# EAGLE design energy_shield (EAGLE 9.4.2)
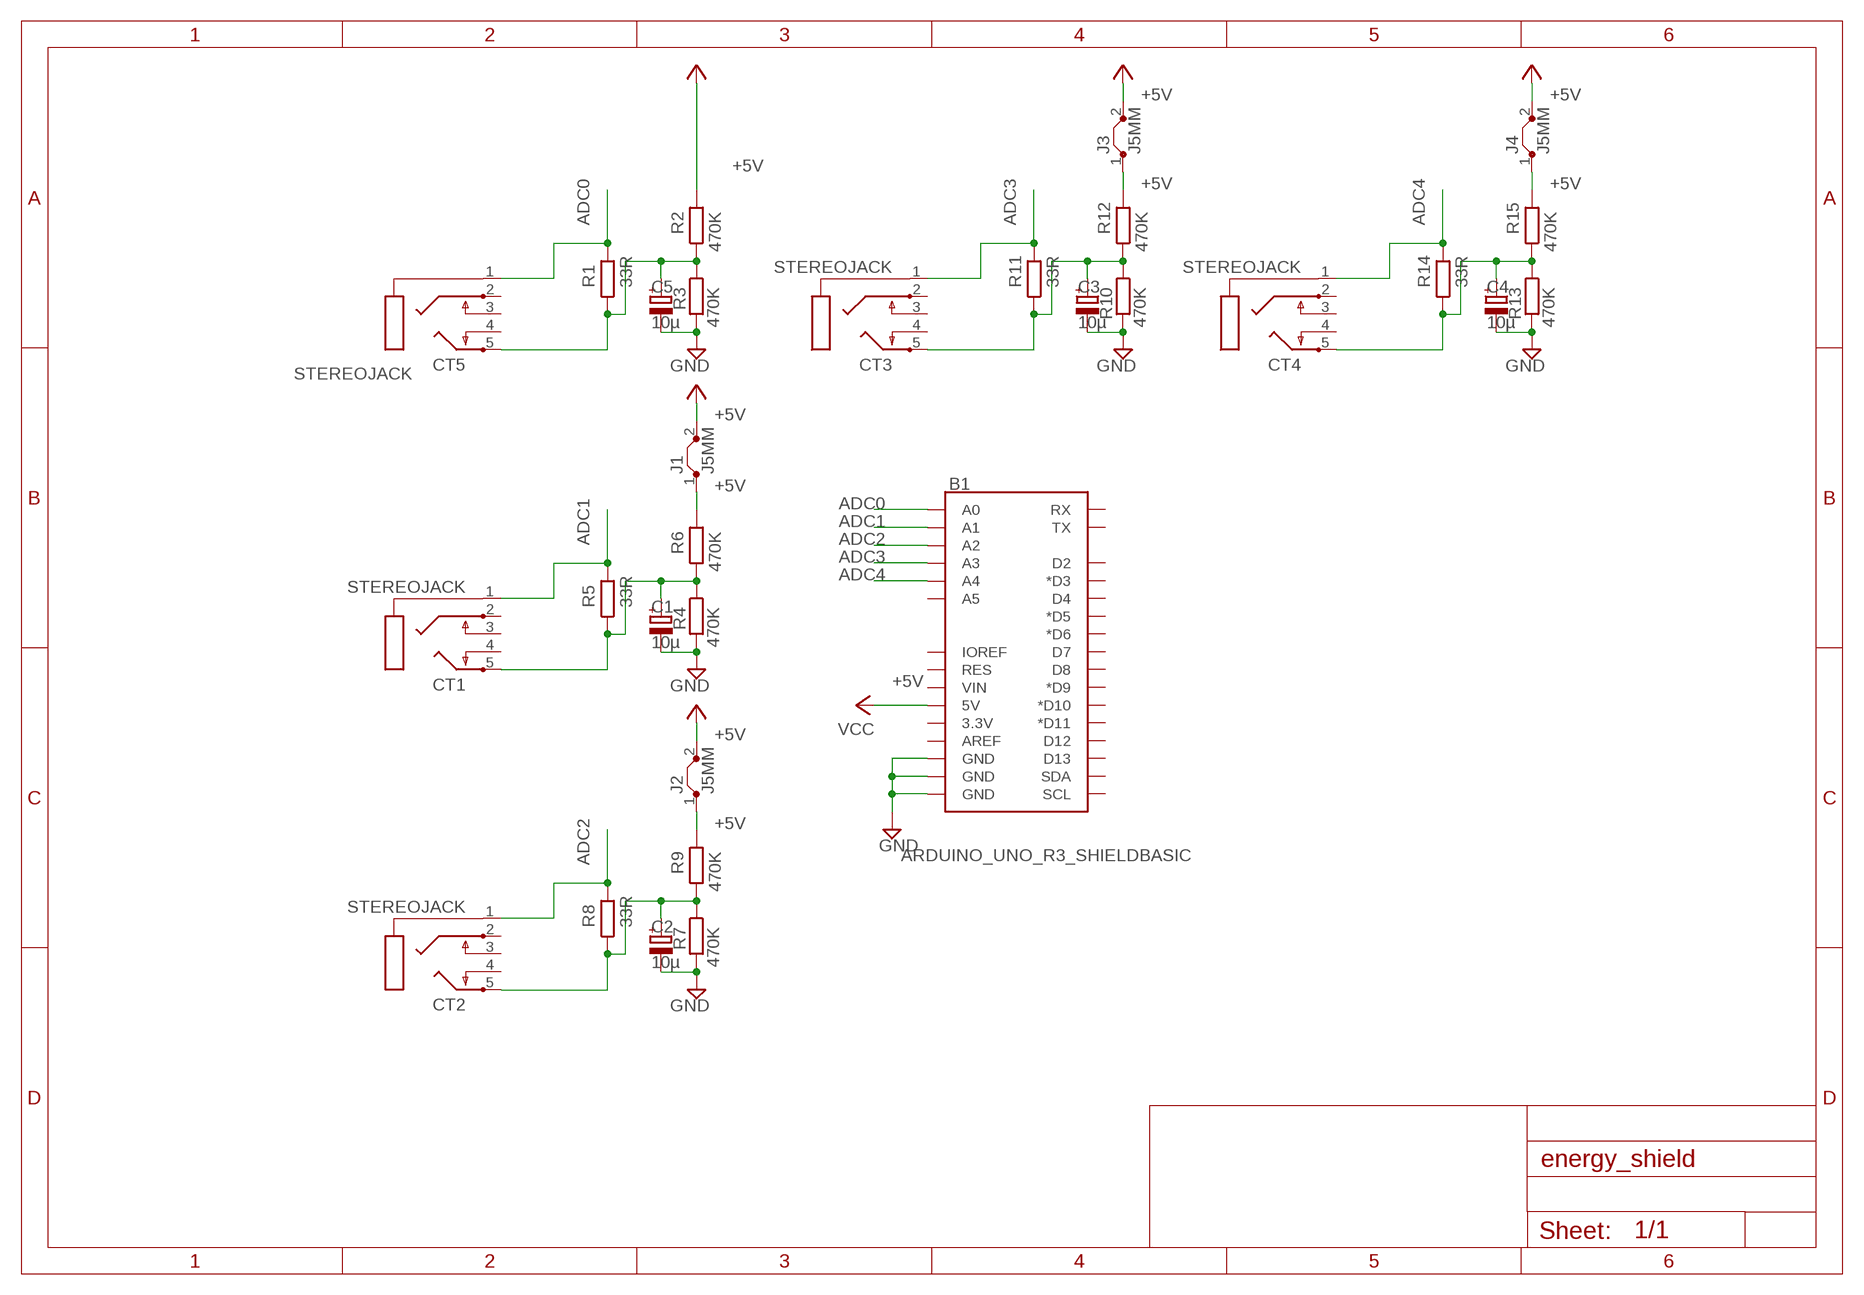
[diagram p0: schematic, sheet 1]

## Parts
B1  ARDUINO_UNO_R3_SHIELDBASIC  [UNO_R3_SHIELD]
C1  10µ  CPOL-EUE1.8-4  [E1,8-4]
C2  10µ  CPOL-EUE1.8-4  [E1,8-4]
C3  10µ  CPOL-EUE1.8-4  [E1,8-4]
C4  10µ  CPOL-EUE1.8-4  [E1,8-4]
C5  10µ  CPOL-EUE1.8-4  [E1,8-4]
CT1  STEREOJACK  [STX3100]
CT2  STEREOJACK  [STX3100]
CT3  STEREOJACK  [STX3100]
CT4  STEREOJACK  [STX3100]
CT5  STEREOJACK  [STX3100]
J1  J5MM  [05]
J2  J5MM  [05]
J3  J5MM  [05]
J4  J5MM  [05]
R1  33R  R-EU_0204/7  [0204/7]
R2  470K  R-EU_0204/7  [0204/7]
R3  470K  R-EU_0204/7  [0204/7]
R4  470K  R-EU_0204/7  [0204/7]
R5  33R  R-EU_0204/7  [0204/7]
R6  470K  R-EU_0204/7  [0204/7]
R7  470K  R-EU_0204/7  [0204/7]
R8  33R  R-EU_0204/7  [0204/7]
R9  470K  R-EU_0204/7  [0204/7]
R10  470K  R-EU_0204/7  [0204/7]
R11  33R  R-EU_0204/7  [0204/7]
R12  470K  R-EU_0204/7  [0204/7]
R13  470K  R-EU_0204/7  [0204/7]
R14  33R  R-EU_0204/7  [0204/7]
R15  470K  R-EU_0204/7  [0204/7]

## Nets
+5V [power]: B1.5V J1.1 J1.2 J2.1 J2.2 J3.1 J3.2 J4.1 J4.2 R2.2 R6.2 R9.2 R12.2 R15.2 ; supply symbol labelled VCC
ADC0: B1.A0 CT5.1 R1.2
ADC1: B1.A1 CT1.1 R5.2
ADC2: B1.A2 CT2.1 R8.2
ADC3: B1.A3 CT3.1 R11.2
ADC4: B1.A4 CT4.1 R14.2
GND [gnd]: B1.GND@0(GND) B1.GND@1(GND) B1.GND@2(GND) C1.- C2.- C3.- C4.- C5.- R3.2 R4.2 R7.2 R10.2 R13.2
N$1: C1.+ CT1.5 R4.1 R5.1 R6.1
N$2: C2.+ CT2.5 R7.1 R8.1 R9.1
N$3: C3.+ CT3.5 R10.1 R11.1 R12.1
N$4: C5.+ CT5.5 R1.1 R2.1 R3.1
N$5: C4.+ CT4.5 R13.1 R14.1 R15.1
Unconnected: B1.3.3V B1.A5 B1.AREF B1.D2 B1.D3(*D3) B1.D4 B1.D5(*D5) B1.D6(*D6) B1.D7 B1.D8 B1.D9(*D9) B1.D10(*D10) B1.D11(*D11) B1.D12 B1.D13 B1.IOREF B1.RES B1.RX B1.SCL B1.SDA B1.TX B1.VIN CT1.2 CT1.3 CT1.4 CT2.2 CT2.3 CT2.4 CT3.2 CT3.3 CT3.4 CT4.2 CT4.3 CT4.4 CT5.2 CT5.3 CT5.4

## Library data of the parts
B1 = SparkFun-Boards:ARDUINO_UNO_R3_SHIELD: Arduino R3 Shield Footprint Shield form compatible with the Arduino Uno R3. SparkFun Products: MG2639 Cellular Shield <https://www.sparkfun.com/products/13120> MIDI Shield <https://www.sparkfun.com/products/12898> R3 Stackable Headers Kit <https://www.sparkfun.com/products/11417>
C1-C5 = resistor:CPOL-EU: POLARIZED CAPACITOR, European symbol
CT1-CT5 = adafruit:STEREOJACK: MIC/HEADPHONE JACK Stereo jack with two switches. Kycon STX3100, CUI SJ1-3555NG and/or 4UCon 05544
J1-J4 = jumper:J: Bridge
R1 R2 R5 R13 = rcl:R-EU_: RESISTOR, European symbol; SPICEPREFIX: R
R3 R4 R6-R12 R14 R15 = rcl:R-EU_: RESISTOR, European symbol

## Net classes
0 default: width 0.203 mm, drill 0.6 mm, clearance 0.203 mm
1 power: width 0.305 mm, drill 0.6 mm, clearance 0.254 mm
2 gnd: width 0.254 mm, drill 0.6 mm, clearance 0.254 mm

## Board
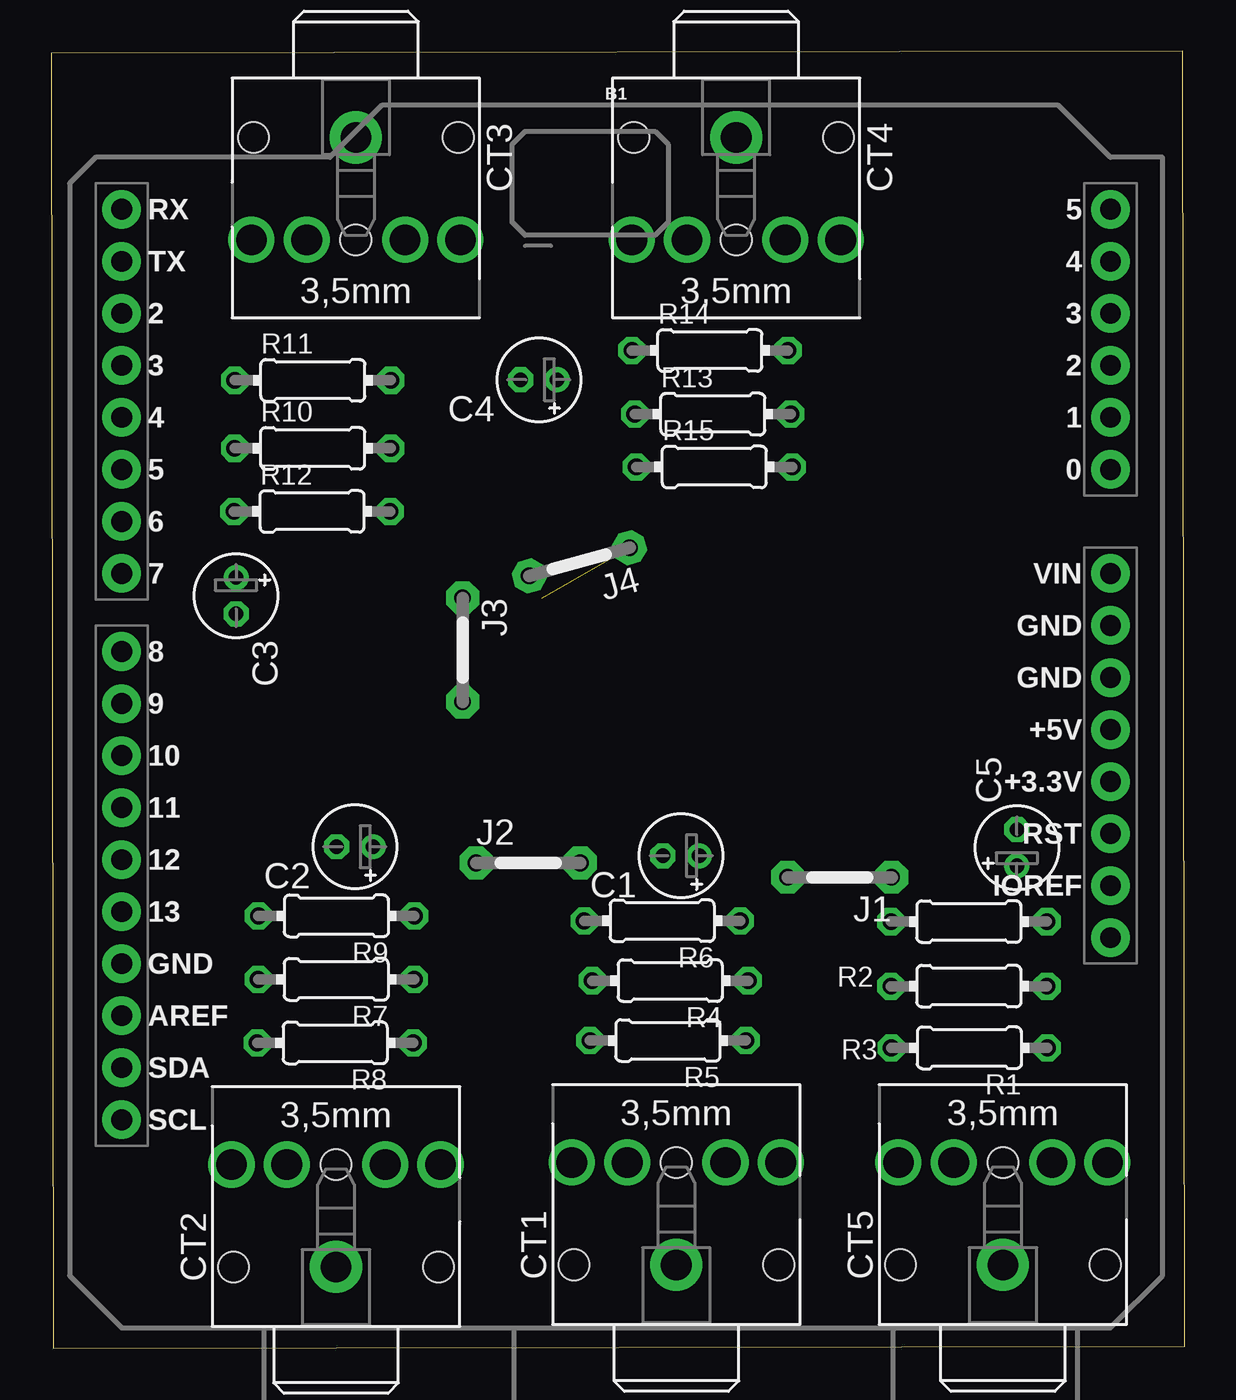
[diagram p1: board, top side]
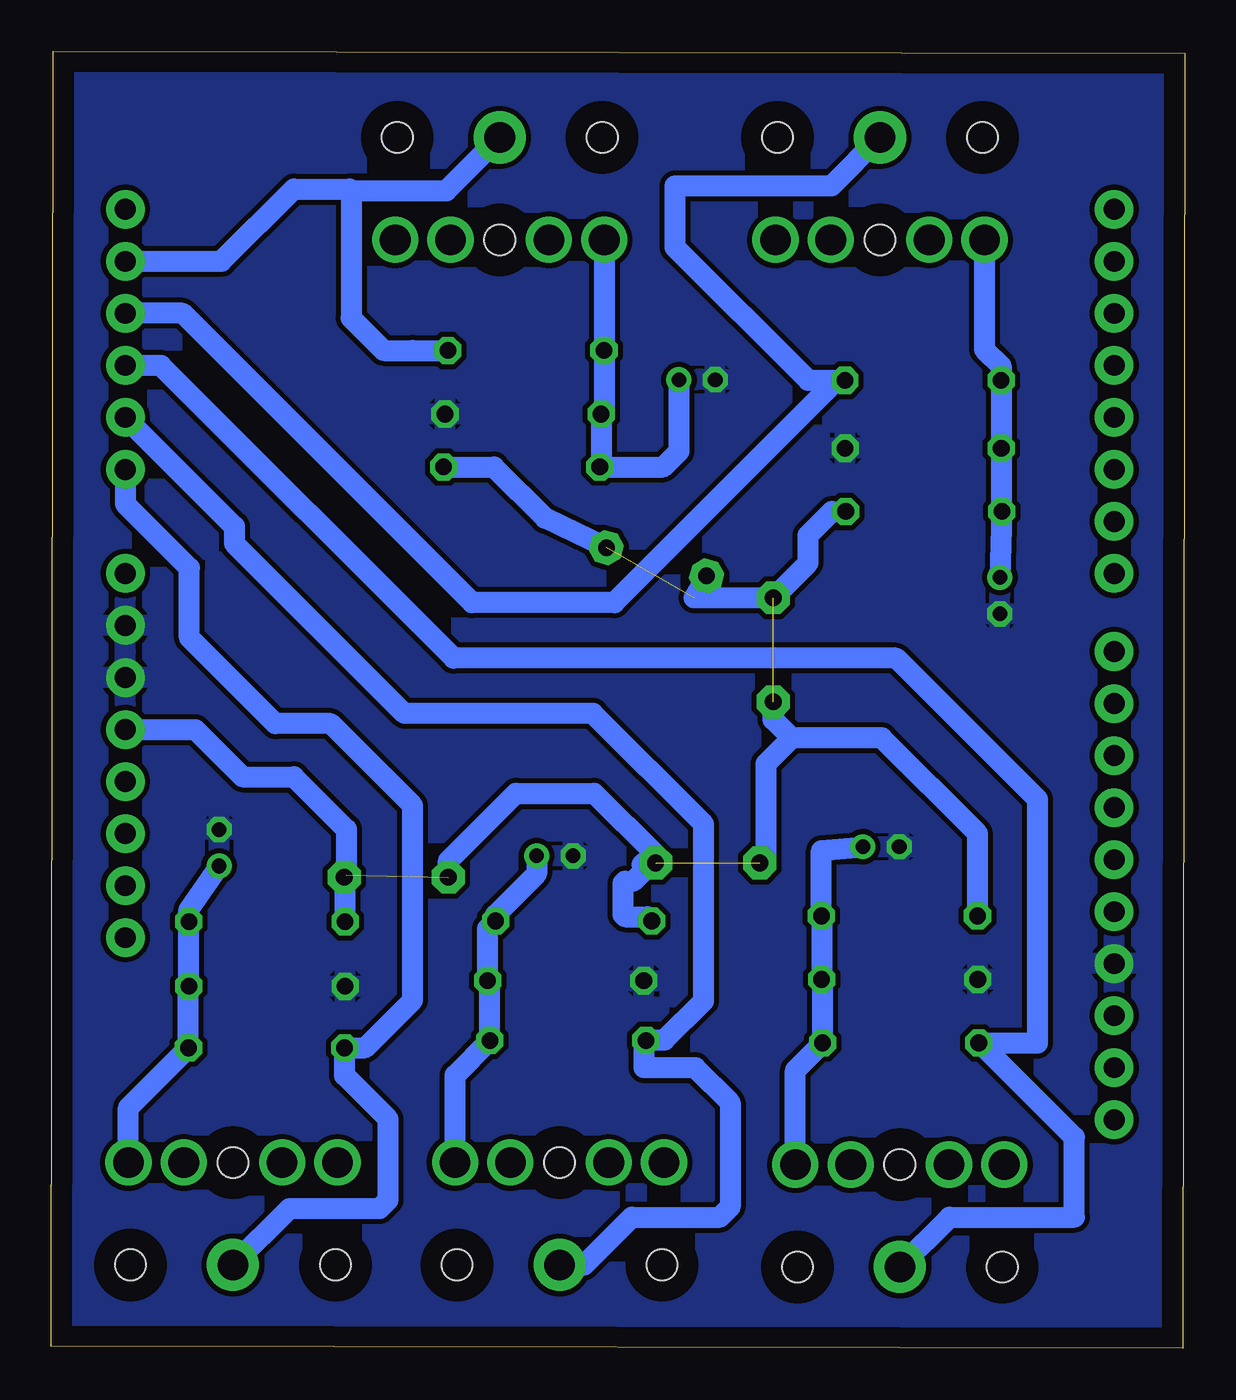
[diagram p2: board, bottom side, seen from below]

Size 55.32 x 63.33 mm. Coordinates in mm from the lower left corner, seen from the top.
Outline: 0.1,0 55.32,0.1 55.22,63.33 0,63.23 0.1,0
Copper layers (1*16): Top 0.035mm / dielectric 1.5mm / Bottom 0.035mm
Design rules "default": minimum track width 6mil, minimum drill 0.35mm, track to track 6mil, track to pad 6mil, pad to pad 6mil, via to via 6mil, smd to smd 6mil, copper to edge 40mil, drill to drill 6mil, minimum pad ring 10mil, minimum via ring 8mil, stop-mask expansion 4mil, vias tented up to drill 0mil, thermal gap 10mil

### Footprints (pad centres in the part's own frame; a part is rotated, then mirrored left to right if it is on the bottom)
UNO_R3_SHIELD = drill 1.016 pad 1.88: 3.3V 24.13,-2.54; 5V 24.13,0; A0 24.13,12.7; A1 24.13,15.24; A2 24.13,17.78; A3 24.13,20.32; A4 24.13,22.86; A5 24.13,25.4; AREF -24.13,-13.97; D2 -24.13,20.32; D3 -24.13,17.78; D4 -24.13,15.24; D5 -24.13,12.7; D6 -24.13,10.16; D7 -24.13,7.62; D8 -24.13,3.81; D9 -24.13,1.27; D10 -24.13,-1.27; D11 -24.13,-3.81; D12 -24.13,-6.35; D13 -24.13,-8.89; GND@0 24.13,2.54; GND@1 24.13,5.08; GND@2 -24.13,-11.43; IOREF 24.13,-7.62; NC 24.13,-10.16; RES 24.13,-5.08; RX -24.13,25.4; SCL -24.13,-19.05; SDA -24.13,-16.51; TX -24.13,22.86; VIN 24.13,7.62
E1,8-4 = drill 0.711 pad 1.168: + -0.889,0 | drill 0.711 pad 1.168 octagon: - 0.889,0
STX3100 = drill 1.5 pad 2.54: 1 2.7,-0.1 | drill 1.5: 2 7.7,5; 3 7.7,2.3; 4 7.7,-2.5; 5 7.7,-5.2 | hole 1.5: 2.7,4.9; 2.7,-5.1; 7.7,-0.1
05 = drill 0.813 pad 1.6 octagon: 1 -2.54,0; 2 2.54,0
0204/7 = drill 0.813 octagon: 1 -3.81,0; 2 3.81,0

### Placement (x,y rotation side)
B1  27.57,30.21 0 top
C1  30.74,24.05 180 top
C2  14.82,24.49 180 top
C3  9.02,36.75 270 top
C4  23.8,47.29 180 top
C5  47.13,24.44 90 top
CT1  30.41,1.37 90 top
CT2  13.8,1.27 90 top
CT3  14.97,61.82 270 top
CT4  33.53,61.82 270 top
CT5  46.35,1.37 90 top
J1  38.48,23 180 top
J2  23.28,23.7 0 top
J3  20.08,34.1 270 top
J4  25.78,38.4 195.7 top
R1  44.81,14.67 180 top
R2  44.79,20.83 180 top
R3  44.79,17.68 180 top
R4  30.21,17.95 180 top
R5  30.1,15.03 180 top
R6  29.82,20.87 180 top
R7  13.91,18.01 180 top
R8  13.86,14.91 180 top
R9  13.92,21.11 180 top
R10  12.76,43.94 0 top
R11  12.77,47.26 0 top
R12  12.73,40.86 0 top
R13  32.29,45.61 0 top
R14  32.15,48.72 0 top
R15  32.36,43.03 0 top

### Tracks (layer width: path | path; a pad name or v marks a point on that pad's centre or on a via)
+5V  (4 unrouted)
  Bottom 1.016: B1.5V 48.29,30.21 45.98,27.9 43.48,27.9 40.92,25.34 40.92,23.1 J1.1 40.98,22.96 R2.2 41.02,20.87 | 26.48,23.6 26.38,23.7 J2.2 | J2.2 26.02,23.7 26.92,22.8 27.32,22.8 27.42,22.7 27.42,21.18 27.31,21.07 26.21,21.07 R6.2 | 19.18,29.8 14.78,29.8 10.11,25.13 R9.2 | 19.18,29.8 20.44,28.54 20.44,24 J2.1 | 19.18,29.8 20.08,30.7 J3.2 | J4.1 31.21,40.53 33.71,43.03 R15.2 | J2.2 25.82,24.1 28.82,27.1 32.64,27.1 35.94,23.8 J1.2 | R12.2 17.22,40.86 18.38,39.7 18.38,38.34 J3.1 23.94,36.64 J4.2
ADC0
  Bottom 1.016: CT5.1 43.69,6.83 39.29,6.83 38.88,7.24 38.88,11.2 41,13.32 R1.2 40,14.67 37.68,16.99 37.68,26.5 41.68,30.5 44.38,30.5 48.58,34.7 48.58,38.1 51.7,41.22 B1.A0
ADC1
  Bottom 1.016: B1.A1 46.38,40.13 46.38,39.3 38.08,31 28.88,31 23.48,25.6 23.48,16.96 25.39,15.05 26.27,15.05 R5.2 26.39,14.93 26.39,13.7 23.88,13.7 22.18,12 22.18,6.9 22.68,6.4 26.98,6.4 29.31,4.07 CT1.1
ADC2
  Bottom 1.016: B1.A2 49.97,47.99 35.68,33.7 14.08,33.7 7.18,26.8 7.18,14.91 R8.2 9.99,14.91 5.38,10.3 5.38,6.4 11.47,6.4 CT2.1
ADC3
  Bottom 1.016: CT3.1 17.23,56.76 24.88,56.76 24.88,53.76 18.38,47.26 R11.2 16.98,47.26 27.84,36.4 34.78,36.4 48.91,50.53 B1.A3
ADC4
  Bottom 1.016: CT4.1 36.03,56.52 40.68,56.52 | 40.68,56.52 40.68,50.3 39.1,48.72 37.68,48.72 R14.2 | B1.A4 47.01,53.07 43.48,56.6 40.76,56.6 40.68,56.52
GND
  pour Bottom: 0.18,62.3 55.18,62.3 55.18,1 0.18,1
N$1
  Bottom 1.016: CT1.5 35.61,13.33 R5.1 33.91,17.84 R4.1 34.02,20.48 R6.1 33.63,21.17 31.63,23.17 C1.+
N$2
  Bottom 1.016: CT2.5 19,13.58 R8.1 17.67,17.96 R7.1 R9.1 17.73,24.3 C2.+
N$3
  Bottom 1.016: CT3.5 9.77,48.77 8.96,47.96 R11.1 R10.1 8.95,40.89 R12.1 C3.+
N$4
  Bottom 1.016: CT5.5 51.55,11.74 R1.1 48.62,17.66 R3.1 R2.1 48.6,21.41 C5.+
N$5
  Bottom 1.016: CT4.5 R14.1 28.34,45.75 R13.1 28.48,43.1 R15.1 25.45,43.03 24.69,43.79 C4.+